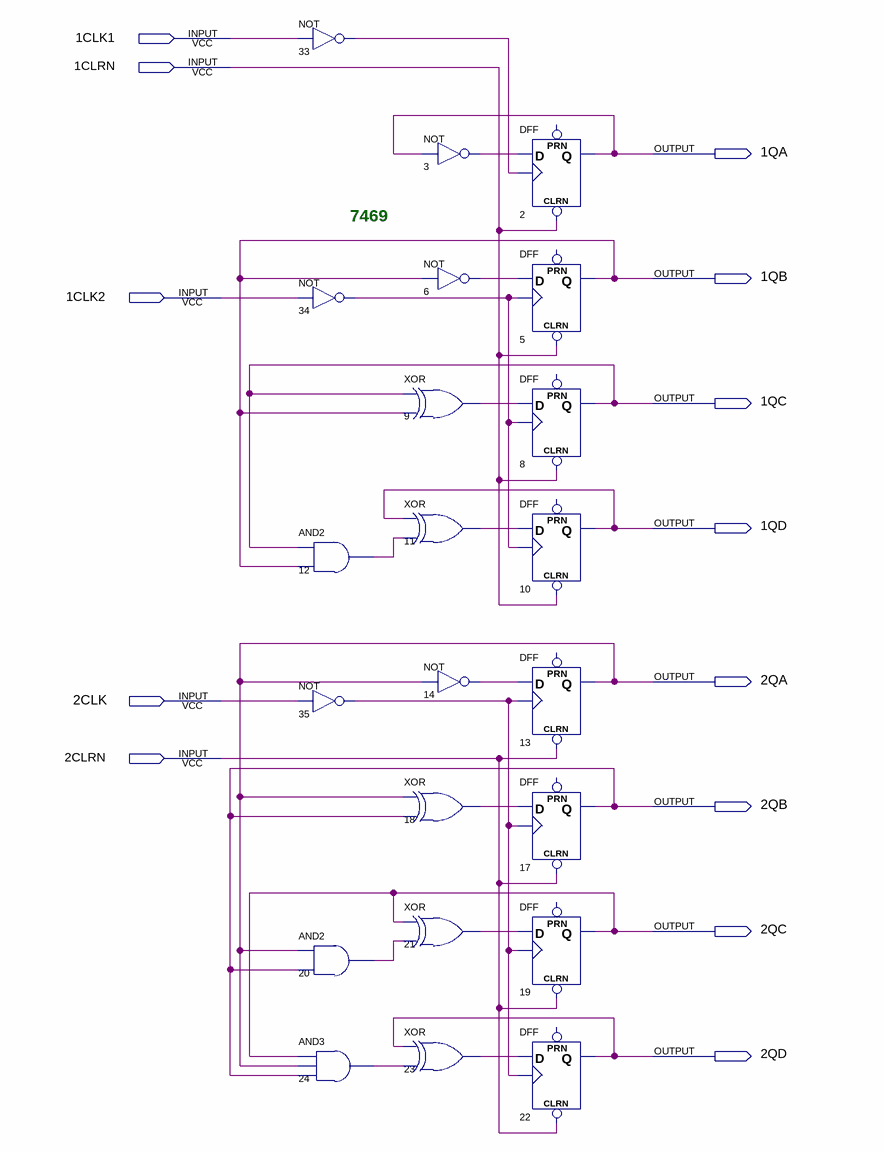
[diagram p0: schematic sheet]
// Quartus schematic 7469.bdf as structural Verilog: 22 symbols, 13 pins
module \7469  (
  input  \1CLK1 ,
  input  \1CLRN ,
  input  \1CLK2 ,
  input  \2CLK ,
  input  \2CLRN ,
  output \1QA ,
  output \1QB ,
  output \1QC ,
  output \1QD ,
  output \2QA ,
  output \2QB ,
  output \2QC ,
  output \2QD 
);

  wire n3_out, n6_out, n9_out, n11_out, n12_out, n14_out, n18_out, n20_out, n21_out, n23_out, n24_out,
       n33_out, n34_out, n35_out;

  not u_33 (n33_out, \1CLK1 );
  not u_34 (n34_out, \1CLK2 );
  and u_12 (n12_out, \1QC , \1QB );
  not u_35 (n35_out, \2CLK );
  and u_20 (n20_out, \2QA , \2QB );
  and u_24 (n24_out, \2QC , \2QA , \2QB );
  not u_3 (n3_out, \1QA );
  not u_6 (n6_out, \1QB );
  xor u_9 (n9_out, \1QC , \1QB );
  xor u_11 (n11_out, \1QD , n12_out);
  not u_14 (n14_out, \2QA );
  xor u_18 (n18_out, \2QA , \2QB );
  xor u_21 (n21_out, \2QC , n20_out);
  xor u_23 (n23_out, \2QD , n24_out);
  DFF u_2 (.CLRN(\1CLRN ), .CLK(n33_out), .D(n3_out), .Q(\1QA ));  // open: PRN
  DFF u_5 (.CLRN(\1CLRN ), .CLK(n34_out), .D(n6_out), .Q(\1QB ));  // open: PRN
  DFF u_8 (.CLRN(\1CLRN ), .CLK(n34_out), .D(n9_out), .Q(\1QC ));  // open: PRN
  DFF u_10 (.CLRN(\1CLRN ), .CLK(n34_out), .D(n11_out), .Q(\1QD ));  // open: PRN
  DFF u_13 (.CLRN(\2CLRN ), .CLK(n35_out), .D(n14_out), .Q(\2QA ));  // open: PRN
  DFF u_17 (.CLRN(\2CLRN ), .CLK(n35_out), .D(n18_out), .Q(\2QB ));  // open: PRN
  DFF u_19 (.CLRN(\2CLRN ), .CLK(n35_out), .D(n21_out), .Q(\2QC ));  // open: PRN
  DFF u_22 (.CLRN(\2CLRN ), .CLK(n35_out), .D(n23_out), .Q(\2QD ));  // open: PRN

  // Notes on the sheet:
  //   7469
endmodule
